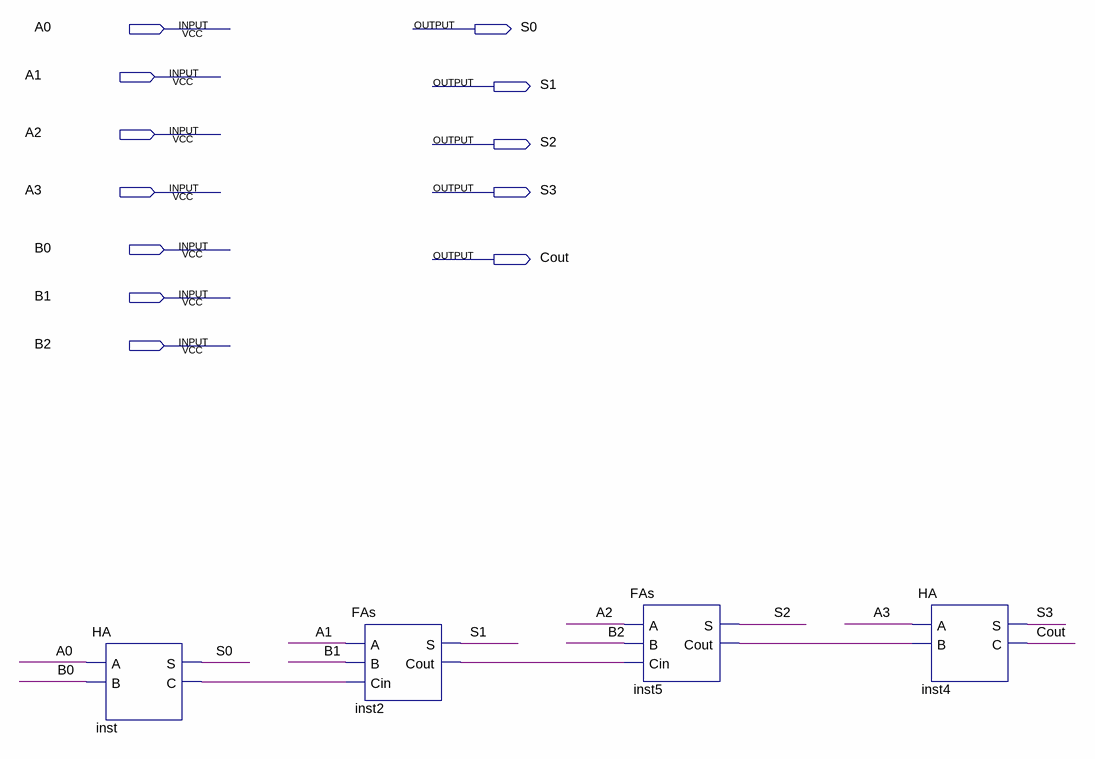
[diagram p0: schematic sheet]
// Quartus schematic RCAi.bdf as structural Verilog: 4 symbols, 12 pins
module RCAi (
  input  A0,
  input  A1,
  input  A2,
  input  A3,
  input  B0,
  input  B1,
  input  B2,
  output S0,
  output S1,
  output S2,
  output S3,
  output Cout
);

  wire inst2_cout, inst5_cout, inst_c;

  HA inst (.A(A0), .B(B0), .S(S0), .C(inst_c));
  FAs inst2 (.A(A1), .B(B1), .Cin(inst_c), .S(S1), .Cout(inst2_cout));
  FAs inst5 (.A(A2), .B(B2), .Cin(inst2_cout), .S(S2), .Cout(inst5_cout));
  HA inst4 (.A(A3), .B(inst5_cout), .S(S3), .C(Cout));
endmodule
